# EAGLE design my1 (EAGLE 7.5.0)
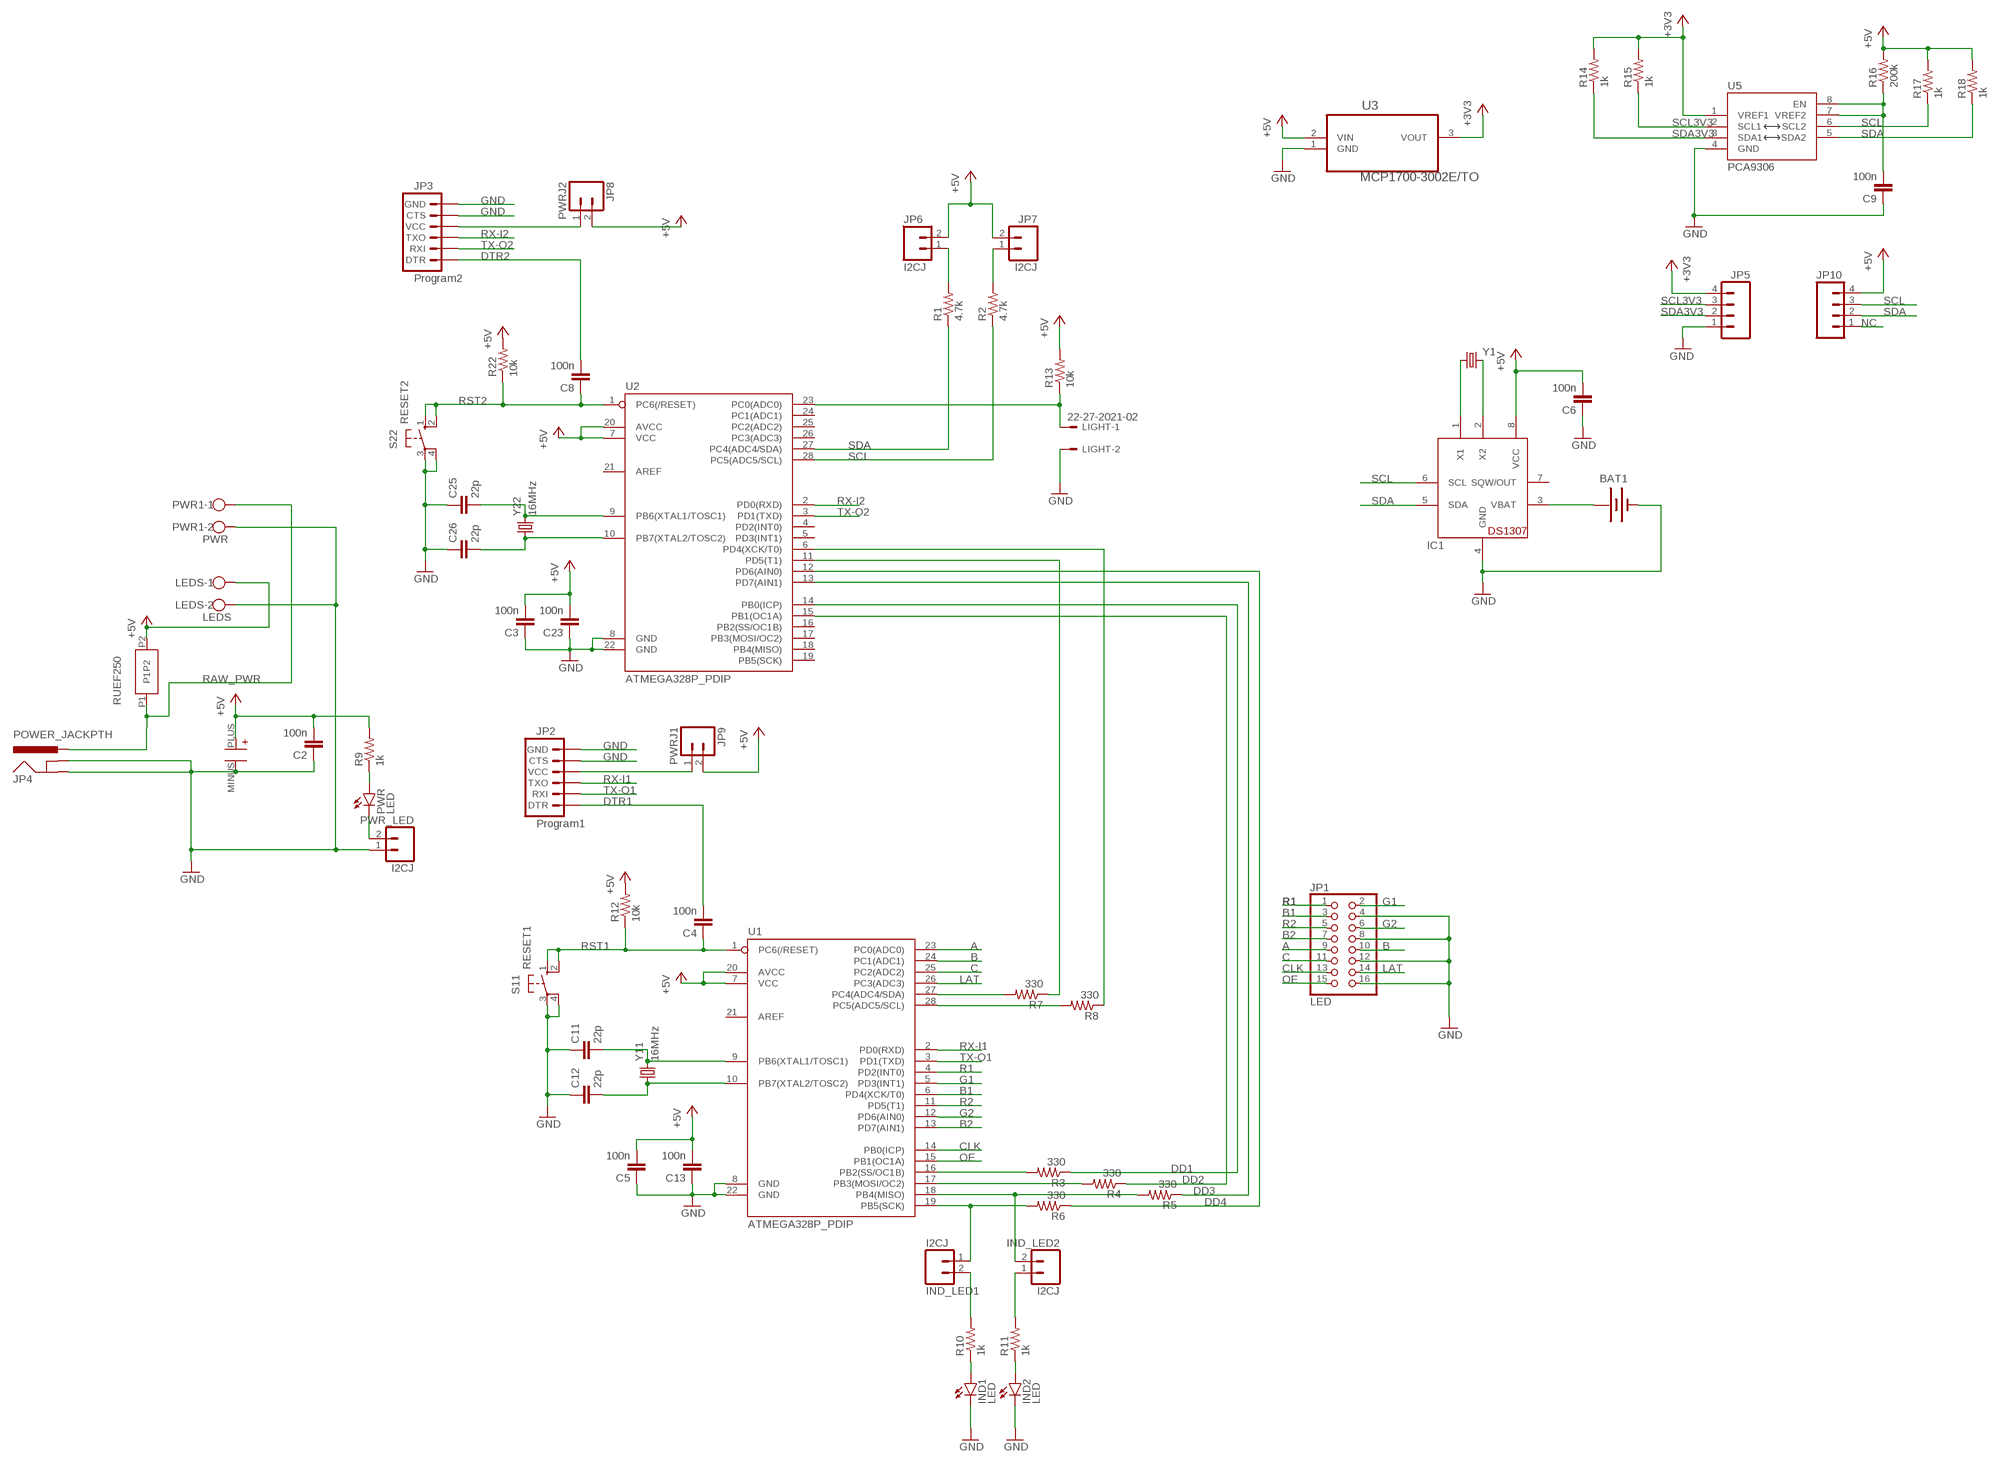
[diagram p0: schematic, sheet 1]

## Parts
BAT1  BATTERY12MM  [BATTCON_12MM]
C1  EEU-FR1C471B  [EEU-FR1C471B]
C2  100n  C-EU025-024X044  [C025-024X044]
C3  100n  C-EU025-024X044  [C025-024X044]
C4  100n  C-EU025-024X044  [C025-024X044]
C5  100n  C-EU025-024X044  [C025-024X044]
C6  100n  C-EU025-024X044  [C025-024X044]
C8  100n  C-EU025-024X044  [C025-024X044]
C9  100n  C-EU025-024X044  [C025-024X044]
C11  22p  C-EU025-024X044  [C025-024X044]
C12  22p  C-EU025-024X044  [C025-024X044]
C13  100n  C-EU025-024X044  [C025-024X044]
C23  100n  C-EU025-024X044  [C025-024X044]
C25  22p  C-EU025-024X044  [C025-024X044]
C26  22p  C-EU025-024X044  [C025-024X044]
IC1  DS1307  [DIL08]
IND1  LED  LED5MM  [LED5MM]
IND2  LED  LED5MM  [LED5MM]
IND_LED1  I2CJ  M02PTH  [1X02]
IND_LED2  I2CJ  M02PTH  [1X02]
JP1  LED  PINHD-2X8  [2X08]
JP2  Program1  ARDUINO_SERIAL_PROGRAMPTH  [1X06]
JP3  Program2  ARDUINO_SERIAL_PROGRAMPTH  [1X06]
JP4  POWER_JACKPTH  [POWER_JACK_PTH]
JP5  M04PTH  [1X04]
JP6  I2CJ  M02PTH  [1X02]
JP7  I2CJ  M02PTH  [1X02]
JP8  PWRJ2  M02PTH  [1X02]
JP9  PWRJ1  M02PTH  [1X02]
JP10  M04PTH  [1X04]
LEDS  LEDS  W237-102  [W237-102]
LIGHT  22-27-2021-02  [6410-02]
PWR  LED  LED5MM  [LED5MM]
PWR1  PWR  W237-102  [W237-102]
PWR_LED  I2CJ  M02PTH  [1X02]
R1  4.7k  RESISTORAXIAL-0.3  [AXIAL-0.3]
R2  4.7k  RESISTORAXIAL-0.3  [AXIAL-0.3]
R3  330  RESISTORAXIAL-0.3  [AXIAL-0.3]
R4  330  RESISTORAXIAL-0.3  [AXIAL-0.3]
R5  330  RESISTORAXIAL-0.3  [AXIAL-0.3]
R6  330  RESISTORAXIAL-0.3  [AXIAL-0.3]
R7  330  RESISTORAXIAL-0.3  [AXIAL-0.3]
R8  330  RESISTORAXIAL-0.3  [AXIAL-0.3]
R9  1k  RESISTORAXIAL-0.3  [AXIAL-0.3]
R10  1k  RESISTORAXIAL-0.3  [AXIAL-0.3]
R11  1k  RESISTORAXIAL-0.3  [AXIAL-0.3]
R12  10k  RESISTORAXIAL-0.3  [AXIAL-0.3]
R13  10k  RESISTORAXIAL-0.3  [AXIAL-0.3]
R14  1k  RESISTORAXIAL-0.3  [AXIAL-0.3]
R15  1k  RESISTORAXIAL-0.3  [AXIAL-0.3]
R16  200k  RESISTORAXIAL-0.3  [AXIAL-0.3]
R17  1k  RESISTORAXIAL-0.3  [AXIAL-0.3]
R18  1k  RESISTORAXIAL-0.3  [AXIAL-0.3]
R22  10k  RESISTORAXIAL-0.3  [AXIAL-0.3]
RUEF250  RUEF250U  [RUEF250U]
S11  RESET1  10-XX  [B3F-10XX]
S22  RESET2  10-XX  [B3F-10XX]
U1  ATMEGA328P_PDIP  [DIL28-3]
U2  ATMEGA328P_PDIP  [DIL28-3]
U3  MCP1700-3002E/TO  [TO127P254X495-3]
U5  PCA9306  [PSOP-8]
Y1  CRYSTAL32-SMD  [CRYSTAL-32KHZ-SMD]
Y11  16MHz  CRYSTALHC49US  [HC49US]
Y22  16MHz  CRYSTALHC49US  [HC49US]

## Nets
+3V3: JP5.4 R14.P$2 R15.P$2 U3.3(VOUT) U5.1(VREF1)
+5V [SUPPLY]: C1.PLUS C2.2 C3.2 C5.2 C6.2 C13.2 C23.2 IC1.8(VCC) JP6.2 JP7.2 JP8.2 JP9.2 JP10.4 LEDS.1 R9.P$2 R12.P$2 R13.P$2 R16.P$2 R17.P$2 R18.P$2 R22.P$2 RUEF250.P2 U1.7(VCC) U1.20(AVCC) U2.7(VCC) U2.20(AVCC) U3.2(VIN)
+5V1: IND_LED1.2 R10.P$2
+5V2: IND_LED2.1 R11.P$2
A: JP1.9 U1.23(PC0(ADC0))
B: JP1.10 U1.24(PC1(ADC1))
B1: JP1.3 U1.6(PD4(XCK/T0))
B2: JP1.7 U1.13(PD7(AIN1))
C: JP1.11 U1.25(PC2(ADC2))
CLK: JP1.13 U1.14(PB0(ICP))
DD1: R3.P$1 U2.14(PB0(ICP))
DD2: R4.P$1 U2.15(PB1(OC1A))
DD3: R5.P$1 U2.13(PD7(AIN1))
DD4: R6.P$1 U2.12(PD6(AIN0))
DTR1: C4.2 JP2.1(DTR)
DTR2: C8.2 JP3.1(DTR)
G1: JP1.2 U1.5(PD3(INT1))
G2: JP1.6 U1.12(PD6(AIN0))
GND [SUPPLY]: BAT1.GND(-) C1.MINUS C2.1 C3.1 C5.1 C6.1 C9.1 C11.1 C12.1 C13.1 C23.1 C25.1 C26.1 IC1.4(GND) IND1.K(C) IND2.K(C) JP1.4 JP1.8 JP1.12 JP1.16 JP2.5(CTS) JP2.6(GND) JP3.5(CTS) JP3.6(GND) JP4.GND JP4.GNDBREAK JP5.1 LEDS.2 LIGHT.2 PWR1.2 PWR_LED.1 S11.3(P) S11.4(P1) S22.3(P) S22.4(P1) U1.8(GND) U1.22(GND) U2.8(GND) U2.22(GND) U3.1(GND) U5.4(GND)
LAT: JP1.14 U1.26(PC3(ADC3))
N$1: C11.2 U1.9(PB6(XTAL1/TOSC1)) Y11.2
N$2: C12.2 U1.10(PB7(XTAL2/TOSC2)) Y11.1
N$3: C25.2 U2.9(PB6(XTAL1/TOSC1)) Y22.2
N$4: C26.2 U2.10(PB7(XTAL2/TOSC2)) Y22.1
N$5: R7.P$1 U2.11(PD5(T1))
N$6: IND_LED1.1 R6.P$2 U1.19(PB5(SCK))
N$7: IND_LED2.2 R5.P$2 U1.18(PB4(MISO))
N$8: R4.P$2 U1.17(PB3(MOSI/OC2))
N$9: R3.P$2 U1.16(PB2(SS/OC1B))
N$10: R7.P$2 U1.27(PC4(ADC4/SDA))
N$11: R8.P$2 U1.28(PC5(ADC5/SCL))
N$12: R8.P$1 U2.6(PD4(XCK/T0))
N$13: JP3.4(VCC) JP8.1
N$14: PWR.A R9.P$1
N$15: PWR.K(C) PWR_LED.2
N$16: JP2.4(VCC) JP9.1
N$17: JP6.1 R1.P$2
N$18: JP7.1 R2.P$2
N$19: IND2.A R11.P$1
N$20: IND1.A R10.P$1
N$21: LIGHT.1 R13.P$1 U2.23(PC0(ADC0))
N$22: C9.2 R16.P$1 U5.7(VREF2) U5.8(EN)
N$24: BAT1.PWR@1(+) IC1.3(VBAT)
N$25: IC1.1(X1) Y1.X1
N$26: IC1.2(X2) Y1.X2
NC: JP10.1
OE: JP1.15 U1.15(PB1(OC1A))
R1: JP1.1 U1.4(PD2(INT0))
R2: JP1.5 U1.11(PD5(T1))
RAW_PWR [SUPPLY]: JP4.PWR PWR1.1 RUEF250.P1
RST1: C4.1 R12.P$1 S11.1(S) S11.2(S1) U1.1(PC6(/RESET))
RST2: C8.1 R22.P$1 S22.1(S) S22.2(S1) U2.1(PC6(/RESET))
RX-I1: JP2.3(TXO) U1.2(PD0(RXD))
RX-I2: JP3.3(TXO) U2.2(PD0(RXD))
SCL: IC1.6(SCL) JP10.3 R2.P$1 R17.P$1 U2.28(PC5(ADC5/SCL)) U5.6(SCL2)
SCL3V3: JP5.3 R15.P$1 U5.2(SCL1)
SDA: IC1.5(SDA) JP10.2 R1.P$1 R18.P$1 U2.27(PC4(ADC4/SDA)) U5.5(SDA2)
SDA3V3: JP5.2 R14.P$1 U5.3(SDA1)
TX-O1: JP2.2(RXI) U1.3(PD1(TXD))
TX-O2: JP3.2(RXI) U2.3(PD1(TXD))
Unconnected: IC1.7(SQW/OUT) U1.21(AREF) U2.4(PD2(INT0)) U2.5(PD3(INT1)) U2.16(PB2(SS/OC1B)) U2.17(PB3(MOSI/OC2)) U2.18(PB4(MISO)) U2.19(PB5(SCK)) U2.21(AREF) U2.24(PC1(ADC1)) U2.25(PC2(ADC2)) U2.26(PC3(ADC3))

## Library data of the parts
BAT1 = SparkFun-Electromechanical:BATTERY: Battery Holders Various common sizes : AA, AAA, 18650 (PRT-12895), 20mm coin cell and 12mm coin cell. 20MM_4LEGS, BATT-10373; PROD_ID: BATT-08044
C1 = my:EEU-FR1C471B
C2-C6 C8 C9 C11-C13 C23 C25 C26 = rcl:C-EU: CAPACITOR, European symbol
IC1 = adafruit:DS1307: DS1307 Real time clock (RTC) with battery backup ability. Talk to it via i2c
IND1 IND2 PWR = SparkFun-LED:LED: LEDs Standard schematic elements and footprints for 5mm, 3mm, 1206, and 0603 sized LEDs. 5mm - Spark Fun Electronics SKU : COM-00529 (and others)
IND_LED1 IND_LED2 JP6-JP9 PWR_LED = SparkFun-Connectors:M02: Standard 2-pin 0.1" header. Use with - straight break away headers ( PRT-00116) - right angle break away headers (PRT-00553) - swiss pins (PRT-00743) - machine pins (PRT-00117) - female headers (PRT-00115) Molex polarized connector foot print use with: PRT-08233 with associated crimp pins and housings. 2.54_SCREWTERM for use with PRT-10571. 3.5mm Screw Terminal footprints for PRT-08084 5mm Screw Terminal footprints for use with PRT-08432
JP1 = pinhead:PINHD-2X8: PIN HEADER
JP2 JP3 = SparkFun-Connectors:ARDUINO_SERIAL_PROGRAM: FTDI connector footprints
JP4 = SparkFun-Connectors:POWER_JACK: Power Jack This is the standard 5.5mm barrel jack for power. The PTH is the most common, proven, reliable, footprint. The Slot footprint only works if the mill layer is transmitted to the PCB fab house so be warned. Mating wall wart : TOL-00298 (and others); PROD_ID: CONN-08197
JP5 JP10 = SparkFun-Connectors:M04: Header 4 Standard 4-pin 0.1" header. Use with straight break away headers (SKU : PRT-00116), right angle break away headers (PRT-00553), swiss pins (PRT-00743), machine pins (PRT-00117), and female headers (PRT-00115). Molex polarized connector foot print use with SKU : PRT-08231 with associated crimp pins and housings. 1MM SMD Version SKU: PRT-10208
LEDS PWR1 = con-wago-500:W237-102: WAGO SCREW CLAMP; MPN: 237-102; OC_FARNELL: unknown; OC_NEWARK: 70K9898
LIGHT = con-molex:22-?-02: CONNECTOR wire to board 2.54 mm (.1 inch) pitch header; OC_FARNELL: unknown; OC_NEWARK: unknown
R1-R18 R22 = SparkFun-Passives:RESISTOR: Resistor Basic schematic elements and footprints for 0603, 1206, and PTH resistors.
RUEF250 = my:RUEF250U
S11 S22 = switch-omron:10-XX: OMRON SWITCH; MPN: B3F-1000; OC_FARNELL: 176432; OC_NEWARK: 36M3542
U1 U2 = SparkFun-DigitalIC:ATMEGA328P_PDIP: uC used in the Arduino 32kb flash, 1k EEPROM, 2k SRAM This is the through-hole version of this chip.
U3 = Microchip_By_element14_Batch_1:MCP1700-3002E/TO: IC REG LDO 250MA 3.0V; MPN: MCP1700-3002E/TO; OC_FARNELL: 1331480; OC_NEWARK: 34M7414; PACKAGE: TO-92; SUPPLIER: Microchip
U5 = SparkFun-DigitalIC:PCA9306: Bidirectional I2C level shifter. NOT compatible with all available part number pinout schemes- DOUBLE CHECK!!!; PROD_ID: IC-10023
Y1 = SparkFun-FreqCtrl:CRYSTAL: Various standard crystals. Proven footprints.; PROD_ID: XTAL-07894
Y11 Y22 = SparkFun-FreqCtrl:CRYSTAL: Various standard crystals. Proven footprints.

## Net classes
0 default: width 0.229 mm, drill 0.381 mm, clearance 0.229 mm
1 SUPPLY: width 0.762 mm, drill 1.524 mm, clearance 0.229 mm

## Board
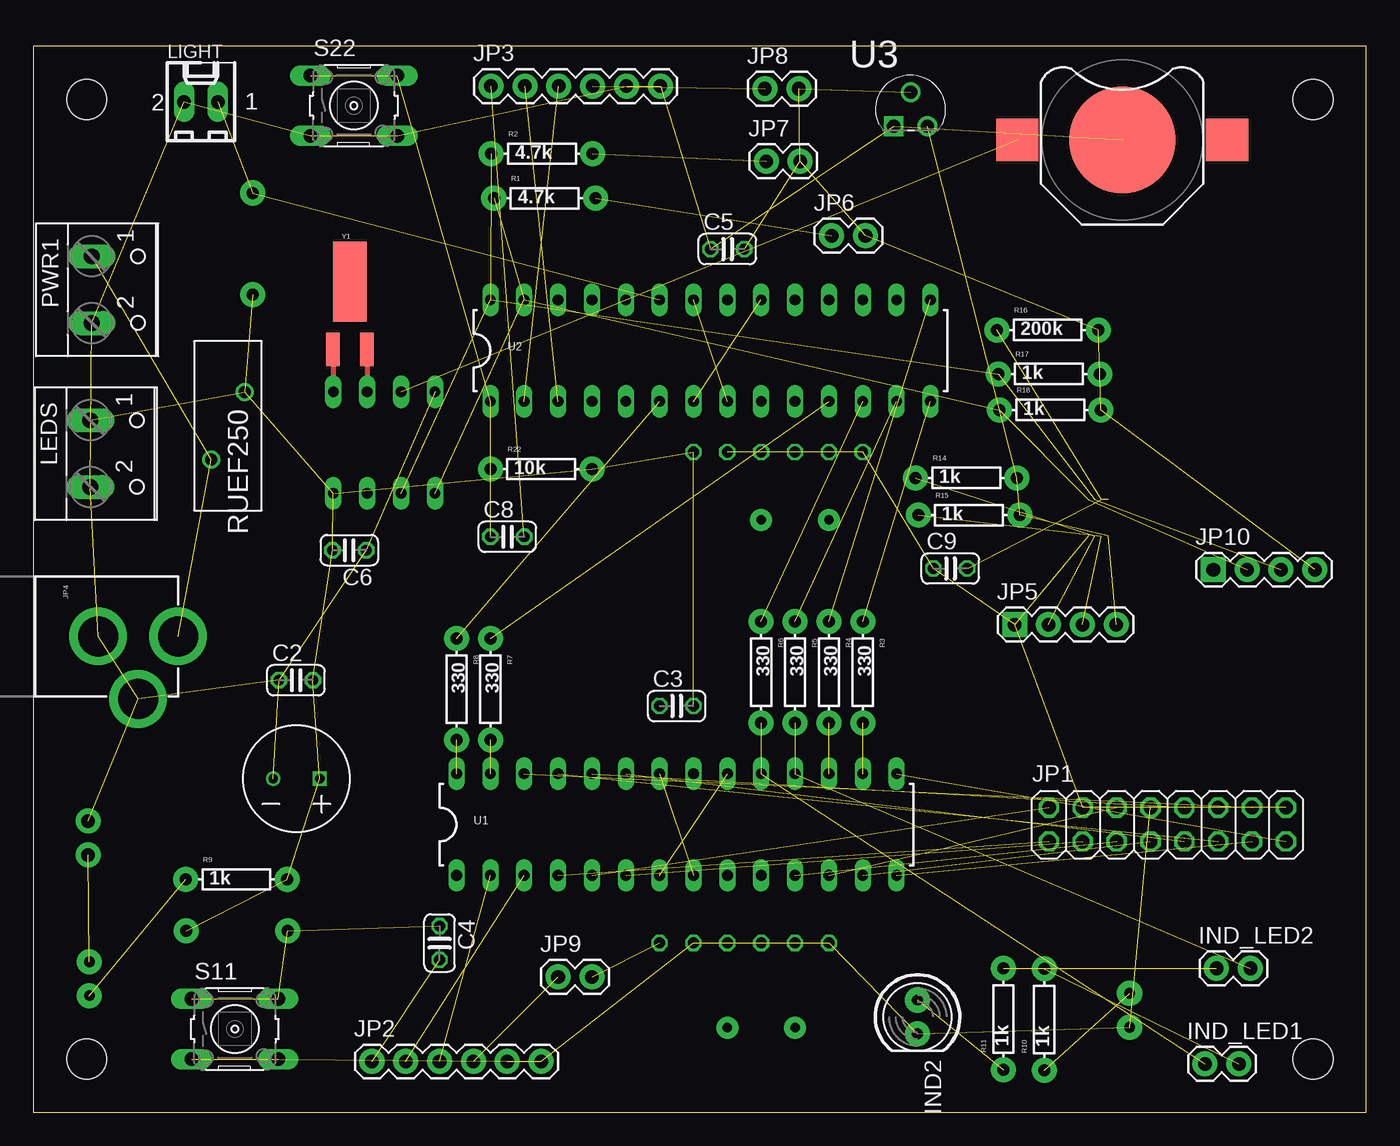
[diagram p1: board, top side]
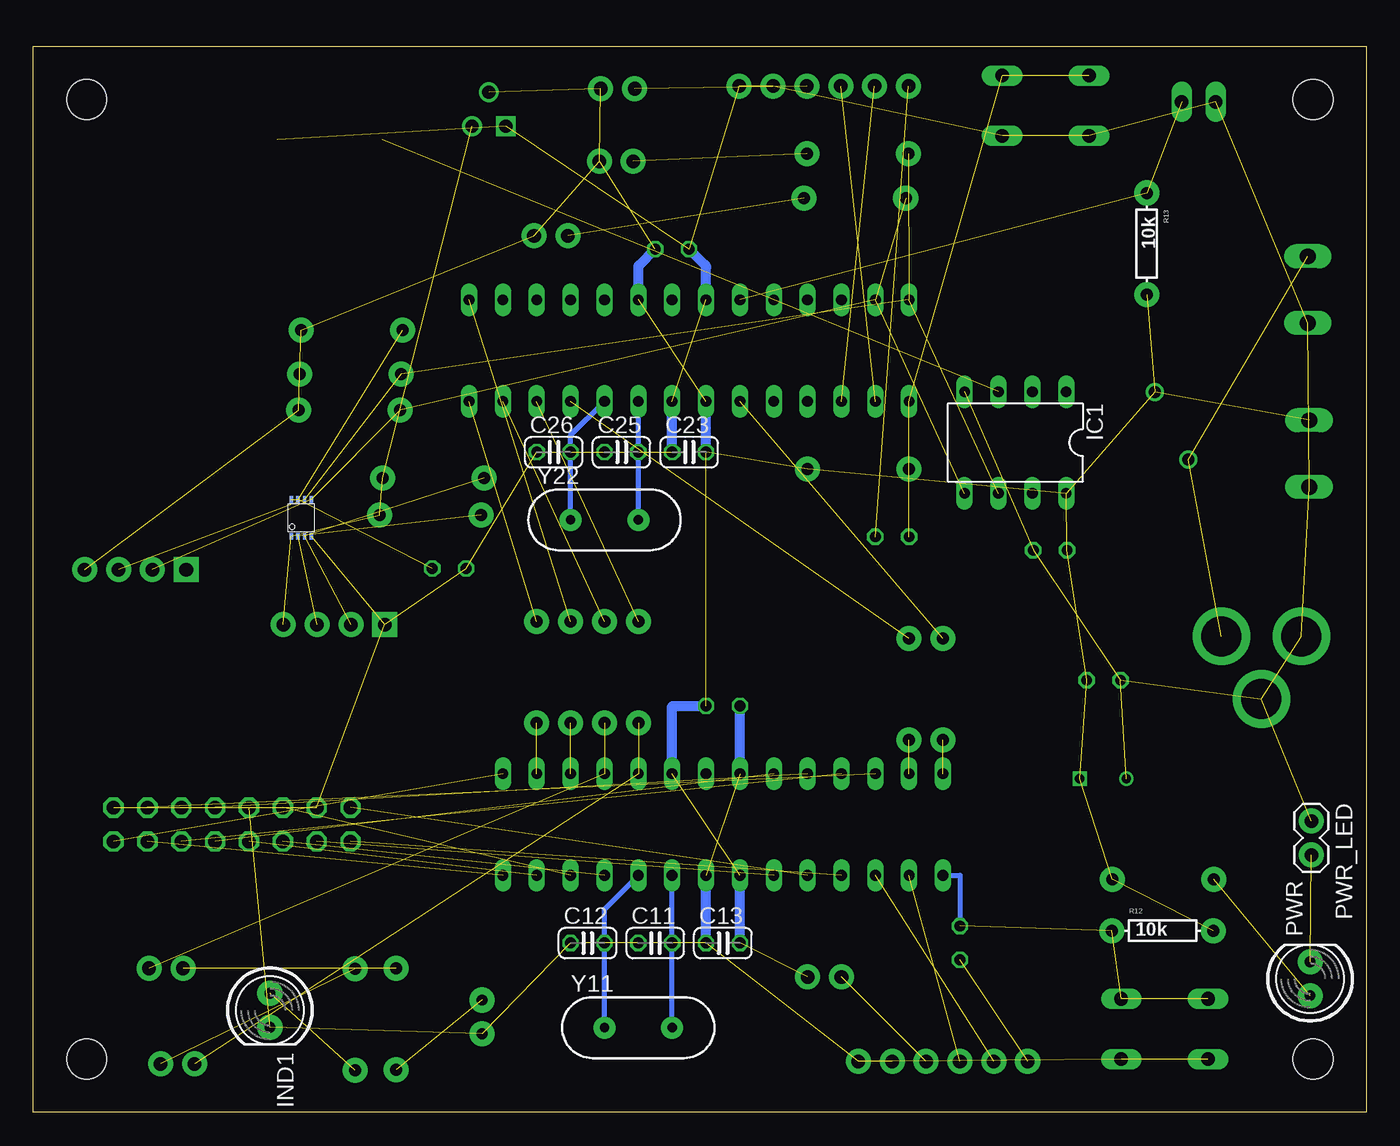
[diagram p2: board, bottom side, seen from below]

Size 100 x 80 mm. Coordinates in mm from the lower left corner, seen from the top.
Outline: 0,0 100,0 100,80 0,80 0,0
Copper layers (1*16): Top 0.0356mm / dielectric 1.5011mm / Bottom 0.0356mm
Design rules "LaenPCBOrder": minimum track width 6mil, minimum drill 13mil, track to track 6mil, track to pad 6mil, pad to pad 6mil, via to via 6mil, smd to smd 6mil, copper to edge 15mil, drill to drill 6mil, minimum pad ring 7mil, minimum via ring 7mil, stop-mask expansion 3mil, vias tented up to drill 0mil, thermal gap 10mil
Holes 3 mm at 4,76 4,4 96,4 96,76
tRestrict: area 20.9,51 to 26.5,59.5
bRestrict: area 20.9,51 to 26.5,59.5

### Footprints (pad centres in the part's own frame; a part is rotated, then mirrored left to right if it is on the bottom)
BATTCON_12MM = smd 8 x 8: GND 0,0 | smd 3.175 x 3.175: PWR@1 -7.874,0; PWR@2 7.874,0
EEU-FR1C471B = drill 0.7: MINUS 1.75,0 | drill 0.7 square: PLUS -1.75,0
C025-024X044 = drill 0.813 octagon: 1 -1.27,0; 2 1.27,0
DIL08 = drill 0.813 long: 1 -3.81,-3.81; 2 -1.27,-3.81; 3 1.27,-3.81; 4 3.81,-3.81; 5 3.81,3.81; 6 1.27,3.81; 7 -1.27,3.81; 8 -3.81,3.81
LED5MM = drill 0.813 pad 1.88: A -1.27,0; K 1.27,0
1X02 = drill 1.016 pad 1.88: 1 0,0; 2 2.54,0
2X08 = drill 1.016 octagon: 1 -8.89,-1.27; 2 -8.89,1.27; 3 -6.35,-1.27; 4 -6.35,1.27; 5 -3.81,-1.27; 6 -3.81,1.27; 7 -1.27,-1.27; 8 -1.27,1.27; 9 1.27,-1.27; 10 1.27,1.27; 11 3.81,-1.27; 12 3.81,1.27; 13 6.35,-1.27; 14 6.35,1.27; 15 8.89,-1.27; 16 8.89,1.27
1X06 = drill 1.016 pad 1.88: 1 0,0; 2 2.54,0; 3 5.08,0; 4 7.62,0; 5 10.16,0; 6 12.7,0
POWER_JACK_PTH = drill 2.997 pad 4.318: GND 0,7.7; GNDBREAK 4.7,10.7; PWR 0,13.7
1X04 = drill 1.016 pad 1.88 square: 1 0,0 | drill 1.016 pad 1.88: 2 2.54,0; 3 5.08,0; 4 7.62,0
W237-102 = drill 1.194 long: 1 -2.5,-1.27; 2 2.5,-1.27
6410-02 = drill 1.016 long: 1 1.27,0; 2 -1.27,0
AXIAL-0.3 = drill 0.9 pad 1.88: P$1 -3.81,0; P$2 3.81,0
RUEF250U = drill 0.9: P1 2.54,-1.27; P2 -2.54,1.27
B3F-10XX = drill 1.016 long: 1 -3.251,2.261; 2 3.251,2.261; 3 -3.251,-2.261; 4 3.251,-2.261
DIL28-3 = drill 0.813 long: 1 -16.51,-3.81; 2 -13.97,-3.81; 3 -11.43,-3.81; 4 -8.89,-3.81; 5 -6.35,-3.81; 6 -3.81,-3.81; 7 -1.27,-3.81; 8 1.27,-3.81; 9 3.81,-3.81; 10 6.35,-3.81; 11 8.89,-3.81; 12 11.43,-3.81; 13 13.97,-3.81; 14 16.51,-3.81; 15 16.51,3.81; 16 13.97,3.81; 17 11.43,3.81; 18 8.89,3.81; 19 6.35,3.81; 20 3.81,3.81; 21 1.27,3.81; 22 -1.27,3.81; 23 -3.81,3.81; 24 -6.35,3.81; 25 -8.89,3.81; 26 -11.43,3.81; 27 -13.97,3.81; 28 -16.51,3.81
TO127P254X495-3 = drill 0.991 square: 1 -2.54,-2.54 | drill 0.991: 2 -1.27,0; 3 0,-2.54
PSOP-8 = smd 0.25 x 0.5: 1 -0.73,-1.37; 2 -0.23,-1.37; 3 0.27,-1.37; 4 0.77,-1.37; 5 0.77,1.38; 6 0.27,1.38; 7 -0.23,1.38; 8 -0.73,1.38
CRYSTAL-32KHZ-SMD = smd 2.5 x 6: SHEILD 0,5.08 | smd 1 x 2.5: X1 -1.27,0; X2 1.27,0
HC49US = drill 0.7 pad 1.651: 1 -2.54,0; 2 2.54,0

### Placement (x,y rotation side)
BAT1  81.7,72.96 0 top
C1  19.74,25.03 180 top
C2  19.7,32.42 0 top
C3  48.26,30.48 0 top
C4  30.48,12.7 270 top
C5  52.07,64.77 0 top
C6  23.71,42.17 180 top
C8  35.56,43.18 0 top
C9  68.8,40.8 0 top
C11  53.34,12.7 0 bottom
C12  58.42,12.7 0 bottom
C13  48.26,12.7 0 bottom
C23  50.8,49.53 0 bottom
C25  55.88,49.53 0 bottom
C26  60.96,49.53 0 bottom
IC1  26.32,50.25 180 bottom
IND1  82.25,7.65 270 bottom
IND2  66.34,7.15 270 top
IND_LED1  87.91,3.63 0 top
IND_LED2  88.77,10.8 0 top
JP1  85.09,21.59 0 top
JP2  25.4,3.81 0 top
JP3  34.34,77 0 top
JP4  -2.84,35.71 270 top
JP5  73.63,36.59 0 top
JP6  59.89,65.77 0 top
JP7  54.99,71.35 0 top
JP8  54.89,76.8 0 top
JP9  39.37,10.16 0 top
JP10  88.53,40.71 0 top
LEDS  5.55,49.42 270 top
LIGHT  12.57,75.82 0 top
PWR  4.21,10.02 90 bottom
PWR1  5.65,61.72 270 top
PWR_LED  4.11,21.85 270 bottom
R1  38.36,68.58 0 top
R2  38.16,71.92 0 top
R3  62.23,33.02 270 top
R4  59.69,33.02 270 top
R5  57.15,33.02 270 top
R6  54.61,33.02 270 top
R7  34.29,31.75 270 top
R8  31.75,31.75 270 top
R9  15.24,17.47 0 top
R10  75.84,6.95 90 top
R11  72.78,7 90 top
R12  15.27,13.62 0 bottom
R13  16.47,65.17 270 bottom
R14  70,47.6 0 top
R15  70.2,44.8 0 top
R16  76.1,58.7 0 top
R17  76.2,55.4 0 top
R18  76.3,52.7 0 top
R22  38.1,48.26 0 top
RUEF250  14.6,51.5 270 top
S11  15.12,6.25 0 top
S22  24.05,75.53 0 top
U1  48.26,21.59 0 top
U2  50.8,57.15 0 top
U3  67.09,76.53 0 top
U5  79.91,44.6 0 bottom
Y1  23.75,57.25 0 top
Y11  54.61,6.35 0 bottom
Y22  57.15,44.45 0 bottom

### Tracks (layer width: path | path; a pad name or v marks a point on that pad's centre or on a via)
+3V3  (4 unrouted)
+5V  (22 unrouted)
  Bottom 0.762: C13.2 U1.7 | U1.20 52.07,30.48 C3.2 | C23.2 U2.7 | U2.20 54.61,63.4 arc45 54.54,63.57 C5.2
+5V1  (1 unrouted)
+5V2  (1 unrouted)
A  (1 unrouted)
B  (1 unrouted)
B1  (1 unrouted)
B2  (1 unrouted)
C  (1 unrouted)
CLK  (1 unrouted)
DD1  (1 unrouted)
DD2  (1 unrouted)
DD3  (1 unrouted)
DD4  (1 unrouted)
DTR1  (1 unrouted)
DTR2  (1 unrouted)
G1  (1 unrouted)
G2  (1 unrouted)
GND  (36 unrouted)
  Bottom 0.762: C13.1 U1.8 | U1.22 C3.1 | C23.1 U2.8 | U2.22 49.53,63.4 arc-45 49.6,63.57 C5.1
LAT  (1 unrouted)
N$1
  Bottom 0.381: Y11.2 C11.2 U1.9
N$2
  Bottom 0.381: U1.10 57.15,15.24 C12.2 Y11.1
N$3
  Bottom 0.381: Y22.2 C25.2 U2.9
N$4
  Bottom 0.381: Y22.1 C26.2 59.69,50.8 U2.10
N$5  (1 unrouted)
N$6  (2 unrouted)
N$7  (2 unrouted)
N$8  (1 unrouted)
N$9  (1 unrouted)
N$10  (1 unrouted)
N$11  (1 unrouted)
N$12  (1 unrouted)
N$13  (1 unrouted)
N$14  (1 unrouted)
N$15  (1 unrouted)
N$16  (1 unrouted)
N$17  (1 unrouted)
N$18  (1 unrouted)
N$19  (1 unrouted)
N$20  (1 unrouted)
N$21  (2 unrouted)
N$22  (3 unrouted)
N$24  (1 unrouted)
N$25
  Top 0.381: Y1.X1 22.51,57.25 IC1.1
N$26
  Top 0.381: Y1.X2 25.05,57.25 IC1.2
OE  (1 unrouted)
R1  (1 unrouted)
R2  (1 unrouted)
RAW_PWR  (2 unrouted)
RST1  (3 unrouted)
  Bottom 0.381: U1.1 30.48,17.78 C4.1
RST2  (4 unrouted)
RX-I1  (1 unrouted)
RX-I2  (1 unrouted)
SCL  (5 unrouted)
SCL3V3  (2 unrouted)
SDA  (5 unrouted)
SDA3V3  (2 unrouted)
TX-O1  (1 unrouted)
TX-O2  (1 unrouted)